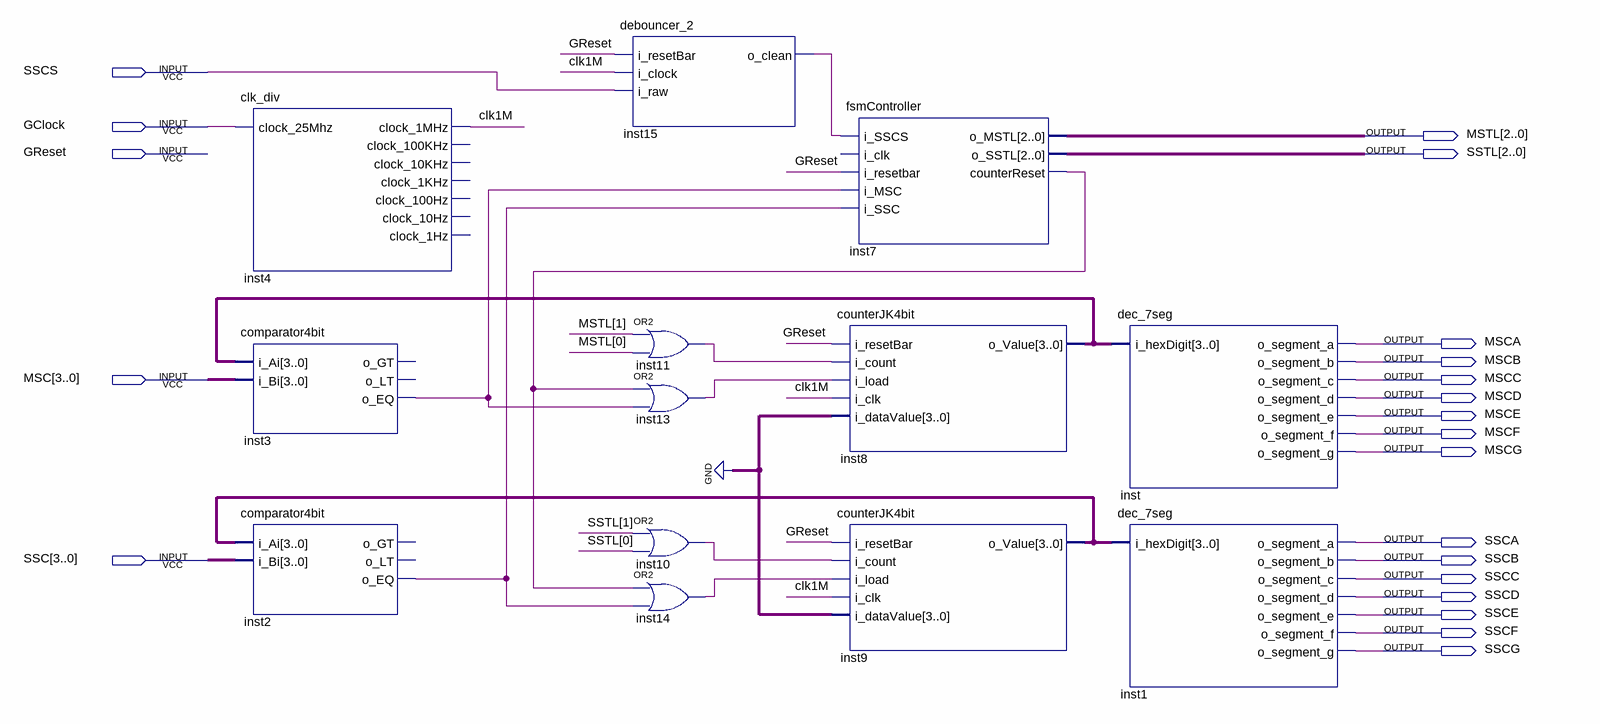
[diagram p0: schematic sheet]
// Quartus schematic lab3 other.bdf as structural Verilog: 13 symbols, 21 pins
module \lab3_other  (
  input  SSCS,
  input  GClock,
  input  GReset,
  input  [3:0] MSC,
  input  [3:0] SSC,
  output [2:0] MSTL,
  output [2:0] SSTL,
  output MSCA,
  output MSCB,
  output MSCC,
  output MSCD,
  output MSCE,
  output MSCF,
  output MSCG,
  output SSCA,
  output SSCB,
  output SSCC,
  output SSCD,
  output SSCE,
  output SSCF,
  output SSCG
);

  wire clk1M, inst2_o_eq, inst3_o_eq, inst7_counterreset, inst10_out, inst11_out, inst13_out, inst14_out,
       inst15_o_clean;
  wire [3:0] inst8_o_value, inst9_o_value;

  clk_div inst4 (
    .clock_25Mhz(GClock), .clock_1MHz(clk1M));  // open: clock_100KHz, clock_10KHz, clock_1KHz, clock_100Hz, clock_10Hz, clock_1Hz
  comparator4bit inst3 (.i_Ai(inst8_o_value), .i_Bi(MSC), .o_EQ(inst3_o_eq));  // open: o_GT, o_LT
  comparator4bit inst2 (.i_Ai(inst9_o_value), .i_Bi(SSC), .o_EQ(inst2_o_eq));  // open: o_GT, o_LT
  debouncer_2 inst15 (.i_resetBar(GReset), .i_clock(clk1M), .i_raw(SSCS), .o_clean(inst15_o_clean));
  or inst11 (inst11_out, MSTL[1], MSTL[0]);
  or inst13 (inst13_out, inst7_counterreset, inst3_o_eq);
  or inst10 (inst10_out, SSTL[1], SSTL[0]);
  or inst14 (inst14_out, inst7_counterreset, inst2_o_eq);
  fsmController inst7 (
    .i_SSCS(inst15_o_clean), .i_resetbar(GReset), .i_MSC(inst3_o_eq), .i_SSC(inst2_o_eq), .o_MSTL(MSTL),
    .o_SSTL(SSTL), .counterReset(inst7_counterreset));  // open: i_clk
  counterJK4bit inst8 (
    .i_resetBar(GReset), .i_count(inst11_out), .i_load(inst13_out), .i_clk(clk1M), .i_dataValue(4'b0000),
    .o_Value(inst8_o_value));
  counterJK4bit inst9 (
    .i_resetBar(GReset), .i_count(inst10_out), .i_load(inst14_out), .i_clk(clk1M), .i_dataValue(4'b0000),
    .o_Value(inst9_o_value));
  dec_7seg inst (
    .i_hexDigit(inst8_o_value), .o_segment_a(MSCA), .o_segment_b(MSCB), .o_segment_c(MSCC),
    .o_segment_d(MSCD), .o_segment_e(MSCE), .o_segment_f(MSCF), .o_segment_g(MSCG));
  dec_7seg inst1 (
    .i_hexDigit(inst9_o_value), .o_segment_a(SSCA), .o_segment_b(SSCB), .o_segment_c(SSCC),
    .o_segment_d(SSCD), .o_segment_e(SSCE), .o_segment_f(SSCF), .o_segment_g(SSCG));
endmodule
